# EAGLE design PowerRailJumper (EAGLE 9.6.2)
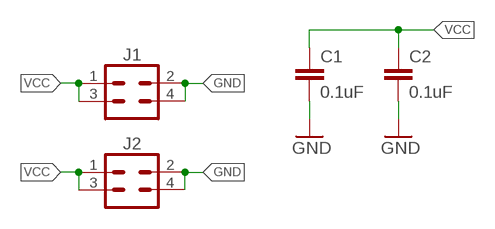
[diagram p0: schematic, sheet 1]

## Parts
C1  0.1uF  C-EU0.1UFC0603  [C0603]
C2  0.1uF  C-EU0.1UFC0603  [C0603]
J1  CONN_2X2  [2X02]
J2  CONN_2X2  [2X02]

## Nets
GND: C1.2 C2.2 J1.2 J1.4 J2.2 J2.4
VCC: C1.1 C2.1 J1.1 J1.3 J2.1 J2.3

## Library data of the parts
C1 C2 = bschulz_passives:C-EU: CAPACITOR, European symbol; DIGIKEY: 490-6051-1-ND; MF: Murata; MPN: GCM188R71E104KA57D
J1 J2 = bschulz:CONN_2X2: Genaric 2x2 terminal header

## Board
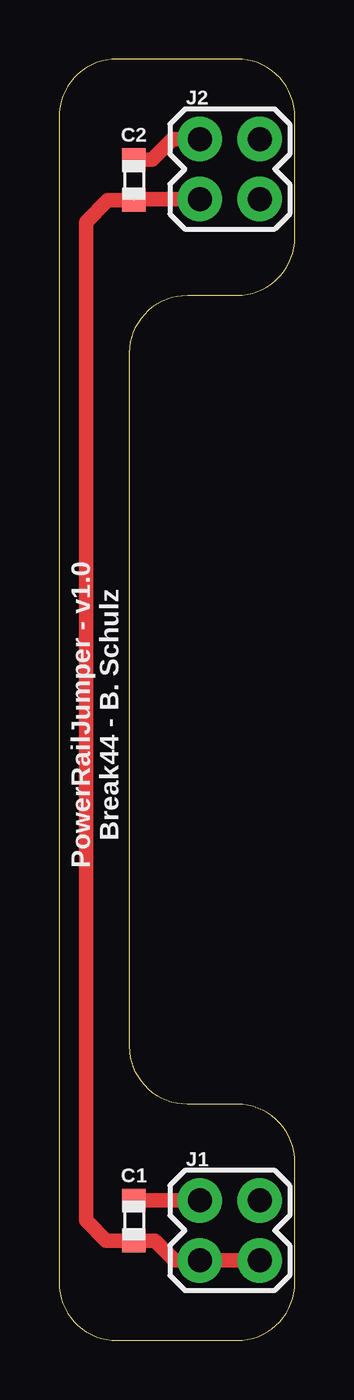
[diagram p1: board, top side]
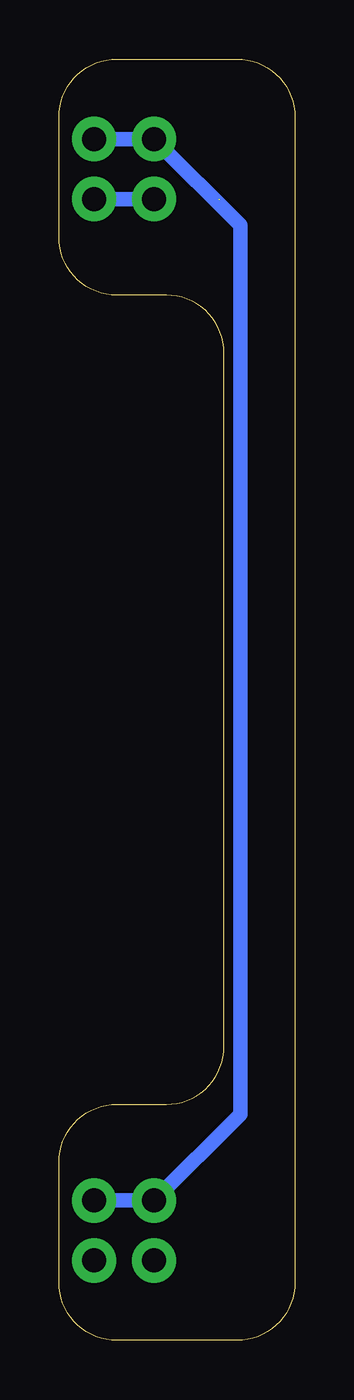
[diagram p2: board, bottom side, seen from below]

Size 10 x 54.27 mm. Coordinates in mm from the lower left corner, seen from the top.
Outline: 10,46.72 10,51.82 arc90 7.55,54.27 2.45,54.27 arc90 0,51.82 0,2.45 arc90 2.45,0 7.55,0 arc90 10,2.45 10,7.55 arc90 7.55,10 5.45,10 arc-90 3,12.45 3,41.82 arc-90 5.45,44.27 7.55,44.27 arc90 10,46.72
Copper layers (1*16): Top 0.035559375mm / dielectric 1.6mm / Bottom 0.035559375mm
Design rules "oshpark-2layer": minimum track width 6mil, minimum drill 10mil, track to track 6mil, track to pad 6mil, pad to pad 6mil, via to via 6mil, smd to smd 6mil, copper to edge 15mil, drill to drill 6mil, minimum pad ring 5mil, minimum via ring 5mil, stop-mask expansion 2.5mil, vias tented up to drill 0mil, thermal gap 10mil

### Footprints (pad centres in the part's own frame; a part is rotated, then mirrored left to right if it is on the bottom)
C0603 = smd 1 x 1: 1 -0.85,0; 2 0.85,0
2X02 = drill 1.016 pad 1.88: 1 0,0; 2 2.54,0; 3 0,-2.54; 4 2.54,-2.54

### Placement (x,y rotation side)
C1  3.17,5.08 270 top
C2  3.17,49.15 270 top
J1  8.51,5.93 270 top
J2  8.51,50.88 270 top

### Tracks (layer width: path | path; a pad name or v marks a point on that pad's centre or on a via)
GND  (1 unrouted)
  Top 0.61: J2.4 3.22,48.34 | J1.2 J1.4 4.91,3.39 4.06,4.23 C1.2 1.99,4.23 1.14,5.08 1.14,47.37 2.07,48.3 C2.2
  Bottom 0.61: J2.2 J2.4
VCC
  Top 0.61: C2.1 3.94,50 4.82,50.88 J2.3 | C1.1 J1.3
  Bottom 0.61: J1.1 J1.3 2.31,9.58 2.31,47.23 J2.3 J2.1

### Text on the board
tPlace: PowerRailJumper - v1.0 / Break44 - B. Schulz